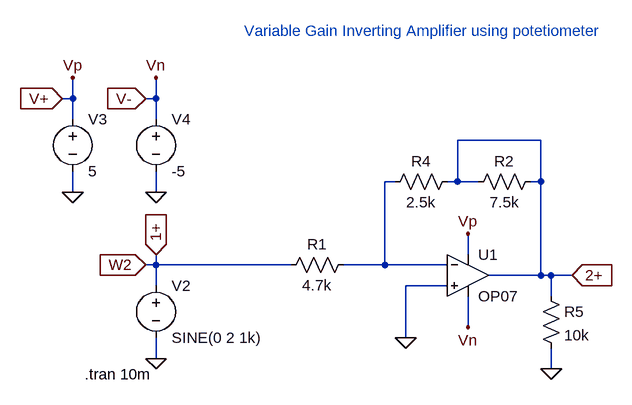
[diagram p0: schematic var_g_invert_amp_pot.asc]
var_g_invert_amp_pot.asc, the LTspice schematic file:
Version 4
SHEET 1 880 680
WIRE -112 64 -112 32
WIRE -112 64 -128 64
WIRE 16 64 16 32
WIRE 16 64 0 64
WIRE -112 96 -112 64
WIRE 16 96 16 64
WIRE 608 128 480 128
WIRE 384 192 368 192
WIRE 480 192 480 128
WIRE 480 192 464 192
WIRE 512 192 480 192
WIRE 608 192 608 128
WIRE 608 192 592 192
WIRE -112 208 -112 176
WIRE 16 208 16 176
WIRE 496 304 496 272
WIRE 16 320 16 304
WIRE 16 320 0 320
WIRE 224 320 16 320
WIRE 368 320 368 192
WIRE 368 320 304 320
WIRE 464 320 368 320
WIRE 608 336 608 192
WIRE 608 336 528 336
WIRE 624 336 608 336
WIRE 656 336 624 336
WIRE 16 352 16 320
WIRE 464 352 400 352
WIRE 624 368 624 336
WIRE 496 416 496 368
WIRE 400 432 400 352
WIRE 16 464 16 432
WIRE 624 480 624 448
FLAG 400 432 0
FLAG 16 464 0
FLAG 624 480 0
FLAG 496 272 Vp
FLAG 496 416 Vn
FLAG -112 208 0
FLAG 16 208 0
FLAG -112 32 Vp
FLAG 16 32 Vn
FLAG -128 64 V+
IOPIN -128 64 In
FLAG 0 64 V-
IOPIN 0 64 In
FLAG 0 320 W2
IOPIN 0 320 In
FLAG 656 336 2+
IOPIN 656 336 In
FLAG 16 304 1+
IOPIN 16 304 In
SYMBOL res 320 304 R90
WINDOW 0 0 56 VBottom 2
WINDOW 3 32 56 VTop 2
SYMATTR InstName R1
SYMATTR Value 4.7k
SYMBOL voltage 16 336 R0
WINDOW 123 0 0 Left 0
WINDOW 39 0 0 Left 0
SYMATTR InstName V2
SYMATTR Value SINE(0 2 1k)
SYMBOL res 480 176 R90
WINDOW 0 0 56 VBottom 2
WINDOW 3 32 56 VTop 2
SYMATTR InstName R4
SYMATTR Value 2.5k
SYMBOL res 608 352 R0
SYMATTR InstName R5
SYMATTR Value 10k
SYMBOL voltage -112 80 R0
WINDOW 123 0 0 Left 0
WINDOW 39 0 0 Left 0
SYMATTR InstName V3
SYMATTR Value 5
SYMBOL voltage 16 80 R0
WINDOW 123 0 0 Left 0
WINDOW 39 0 0 Left 0
SYMATTR InstName V4
SYMATTR Value -5
SYMBOL Opamps\\OP07 496 272 R0
SYMATTR InstName U1
SYMBOL res 608 176 R90
WINDOW 0 0 56 VBottom 2
WINDOW 3 32 56 VTop 2
SYMATTR InstName R2
SYMATTR Value 7.5k
TEXT -94 488 Left 2 !.tran 10m
TEXT 152 -40 Left 2 ;Variable Gain Inverting Amplifier using potetiometer

The netlist it stands for:
* var_g_invert_amp_pot.asc
R1 N001 1+ 4.7k
V2 1+ 0 SINE(0 2 1k)
R4 2+ N001 2.5k
R5 2+ 0 10k
V3 V+ 0 5
V4 V- 0 -5
XU1 0 N001 V+ V- 2+ LT1001  ; OP07, pins In+ In- V+ V- OUT
R2 2+ 2+ 7.5k
.tran 10m
* Variable Gain Inverting Amplifier using potetiometer
.lib LTC.lib
.backanno
.end